# EAGLE design Feather-Extension (EAGLE 9.5.1)
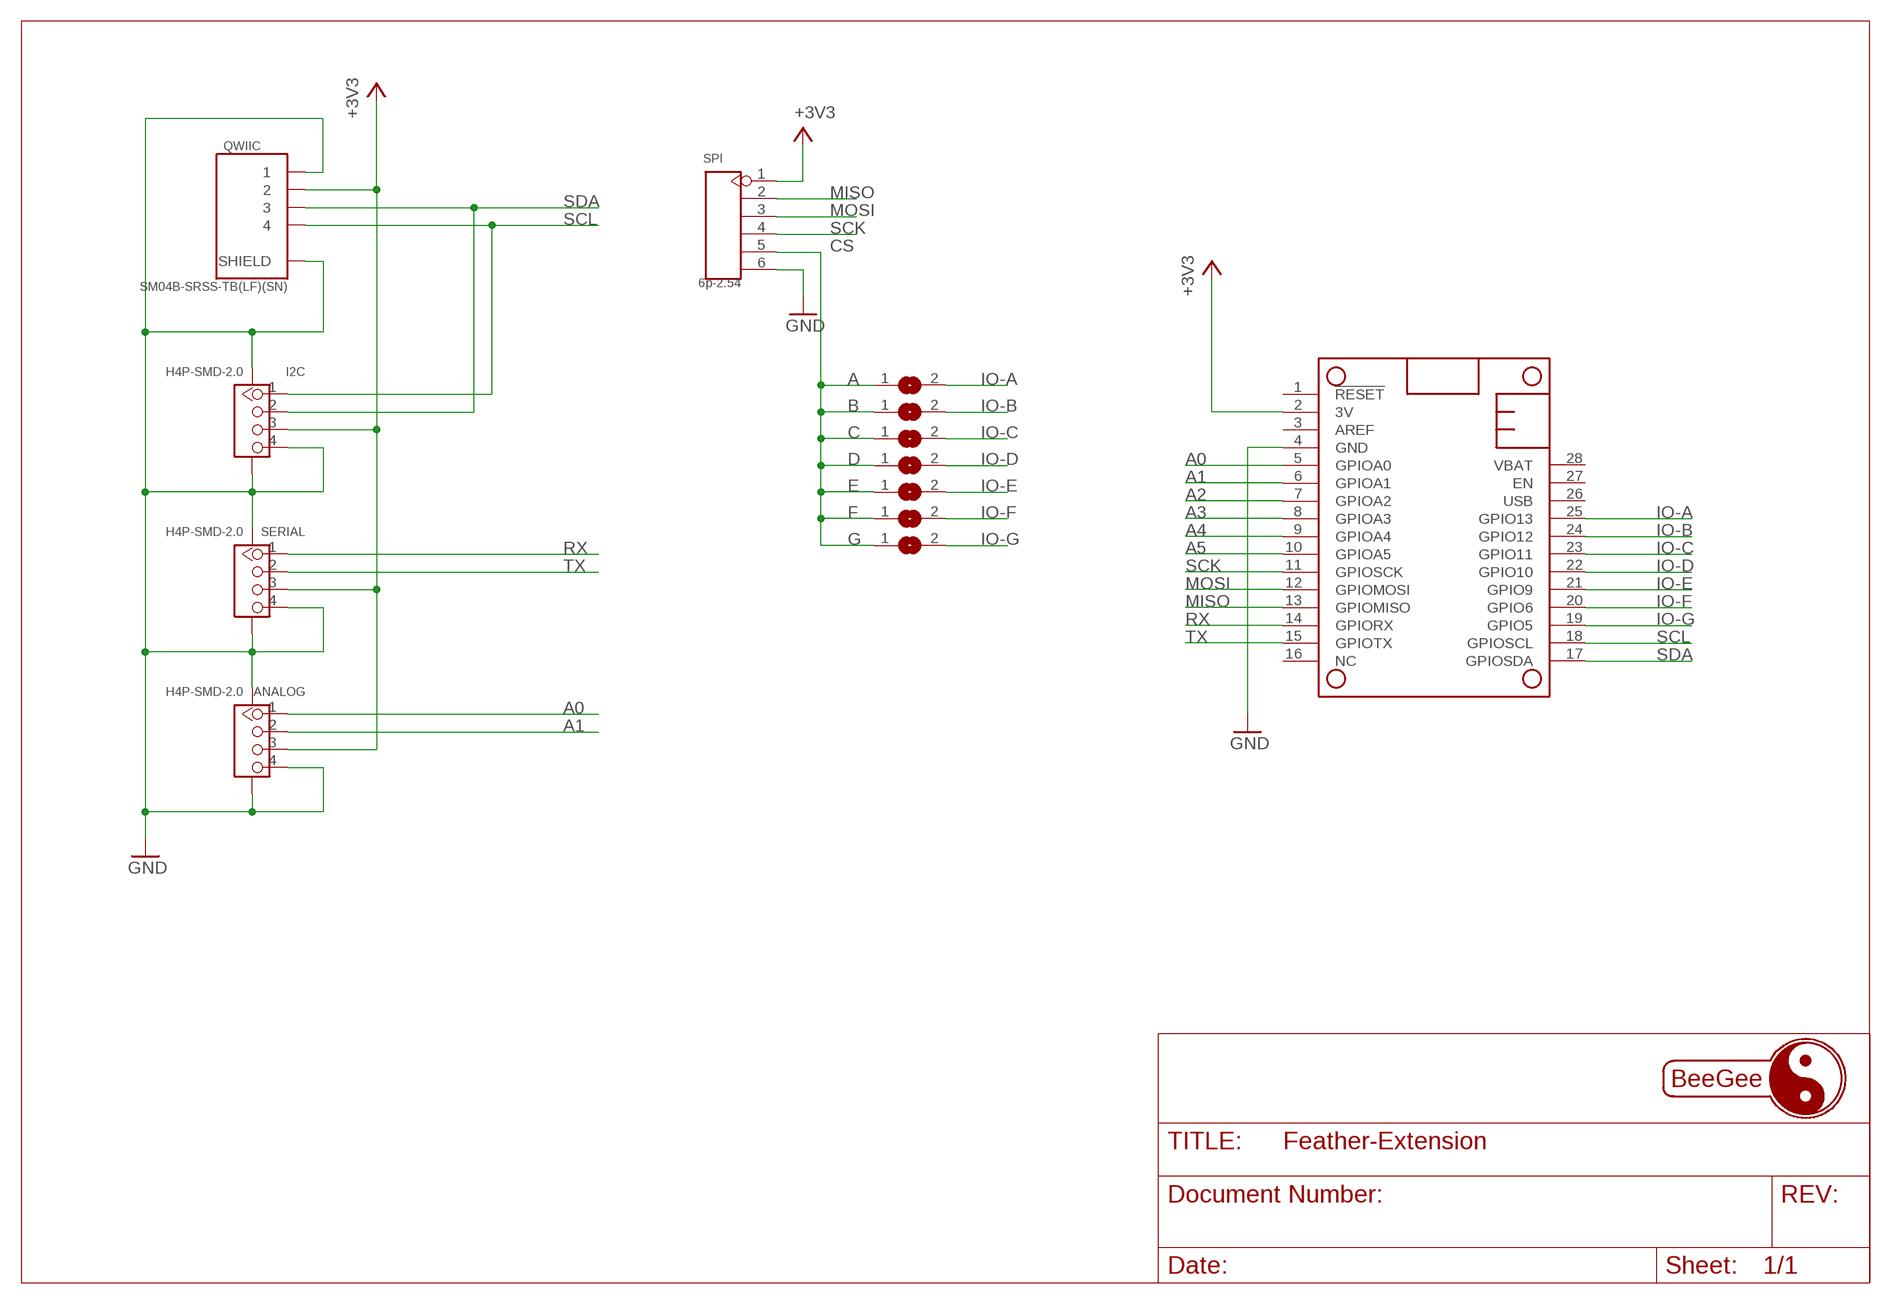
[diagram p0: schematic, sheet 1]

## Parts
A  SJ  [SJ]
ANALOG  H4P-SMD-2.0  GROVE-CONNECTOR-SMD(4+2P-2.0)  [HW4-SMD-2.0]
B  SJ  [SJ]
C  SJ  [SJ]
D  SJ  [SJ]
E  SJ  [SJ]
F  SJ  [SJ]
G  SJ  [SJ]
I2C  H4P-SMD-2.0  GROVE-CONNECTOR-SMD(4+2P-2.0)  [HW4-SMD-2.0]
MS2  FEATHERWING  [FEATHERWING]
QWIIC  SM04B-SRSS-TB(LF)(SN)  [JST_SM04B-SRSS-TB(LF)(SN)]
SERIAL  H4P-SMD-2.0  GROVE-CONNECTOR-SMD(4+2P-2.0)  [HW4-SMD-2.0]
SPI  6p-2.54  DIP-BLACK-MALE-HEADER(6P-2.54)  [H6-2.54]

## Nets
+3V3: ANALOG.3 I2C.3 MS2.2(3V) QWIIC.2 SERIAL.3 SPI.1
A0: ANALOG.1 MS2.5(GPIOA0)
A1: ANALOG.2 MS2.6(GPIOA1)
A2: MS2.7(GPIOA2)
A3: MS2.8(GPIOA3)
A4: MS2.9(GPIOA4)
A5: MS2.10(GPIOA5)
CS: A.1 B.1 C.1 D.1 E.1 F.1 G.1 SPI.5
GND [power]: ANALOG.4 ANALOG.SS1 ANALOG.SS2 I2C.4 I2C.SS1 I2C.SS2 MS2.4(GND) QWIIC.1 QWIIC.S1(SHIELD) QWIIC.S2(SHIELD) SERIAL.4 SERIAL.SS1 SERIAL.SS2 SPI.6
IO-A: A.2 MS2.25(GPIO13)
IO-B: B.2 MS2.24(GPIO12)
IO-C: C.2 MS2.23(GPIO11)
IO-D: D.2 MS2.22(GPIO10)
IO-E: E.2 MS2.21(GPIO9)
IO-F: F.2 MS2.20(GPIO6)
IO-G: G.2 MS2.19(GPIO5)
MISO: MS2.13(GPIOMISO) SPI.2
MOSI: MS2.12(GPIOMOSI) SPI.3
RX: MS2.14(GPIORX) SERIAL.1
SCK: MS2.11(GPIOSCK) SPI.4
SCL: I2C.1 MS2.18(GPIOSCL) QWIIC.4
SDA: I2C.2 MS2.17(GPIOSDA) QWIIC.3
TX: MS2.15(GPIOTX) SERIAL.2
Unconnected: MS2.1(!RESET) MS2.3(AREF) MS2.16(NC) MS2.26(USB) MS2.27(EN) MS2.28(VBAT)

## Library data of the parts
A B C D E F G = jumper:SJ: SMD solder JUMPER
ANALOG I2C SERIAL = OPL_Connector:GROVE-CONNECTOR-SMD(4+2P-2.0): 320110030; #1_SEEED_SKU: 320110030; #2_SEEED_LINK: https://www.seeedstudio.com/opl.html
MS2 = adafruit:FEATHERWING
QWIIC = SM04B-SRSS-TB_LF__SN_:SM04B-SRSS-TB(LF)(SN): SH Series 1.0 mm Pitch 2 Position Single Row Side Entry Shrouded Header; #1_SEEED_SKU: JST SM04B-SRSS-TB_LF_SN; #2_SEEED_LINK: https://order.jst-mfg.com/InternetShop/app/index.php?back=2&product=67585401&jgcd=0#showProductDetail; AVAILABILITY: Unavailable; DESCRIPTION: SH Series 1.0 mm Pitch 2 Position Single Row Side Entry Shrouded Header; MF: JST Sales; MP: SM04B-SRSS-TB_LF__SN_; PACKAGE: None; PRICE: None
SPI = OPL_Connector:DIP-BLACK-MALE-HEADER(6P-2.54): 320020078; #1_SEEED_LINK: https://www.seeedstudio.com/opl.html; #1_SEEED_SKU: 320020078; MPN: P125-1106A1BS116A1

## Net classes
1 power: width 0.356 mm

## Board
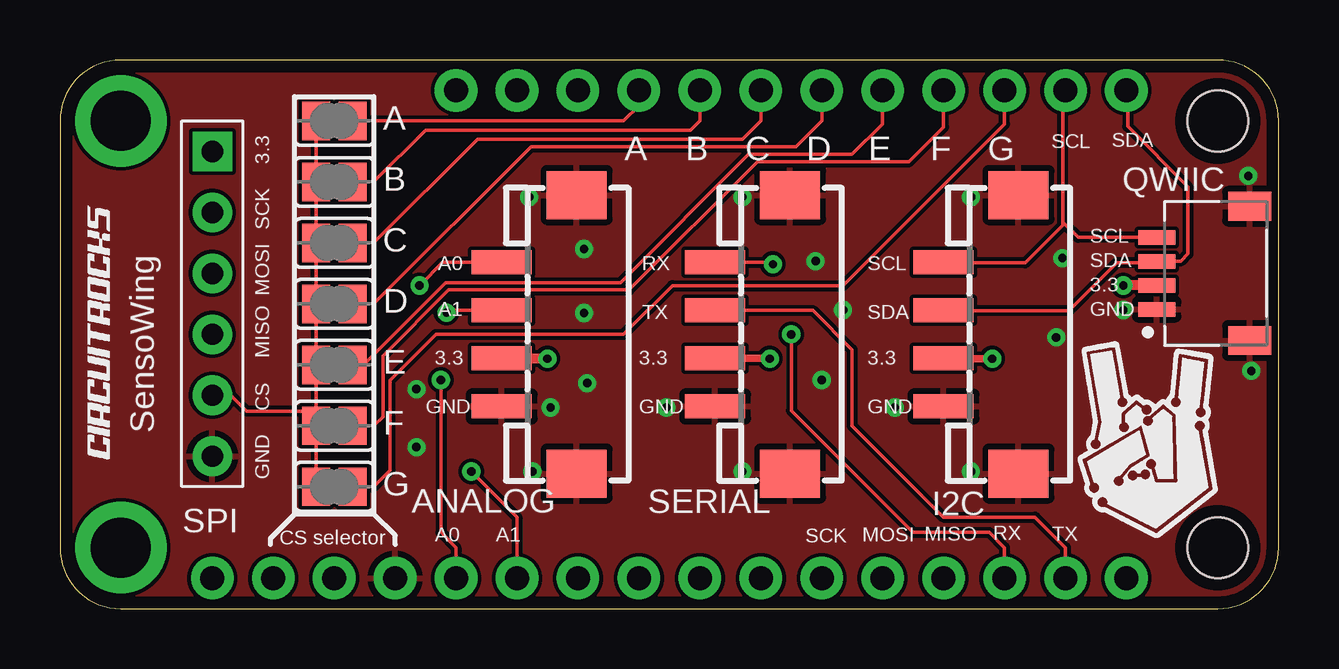
[diagram p1: board, top side]
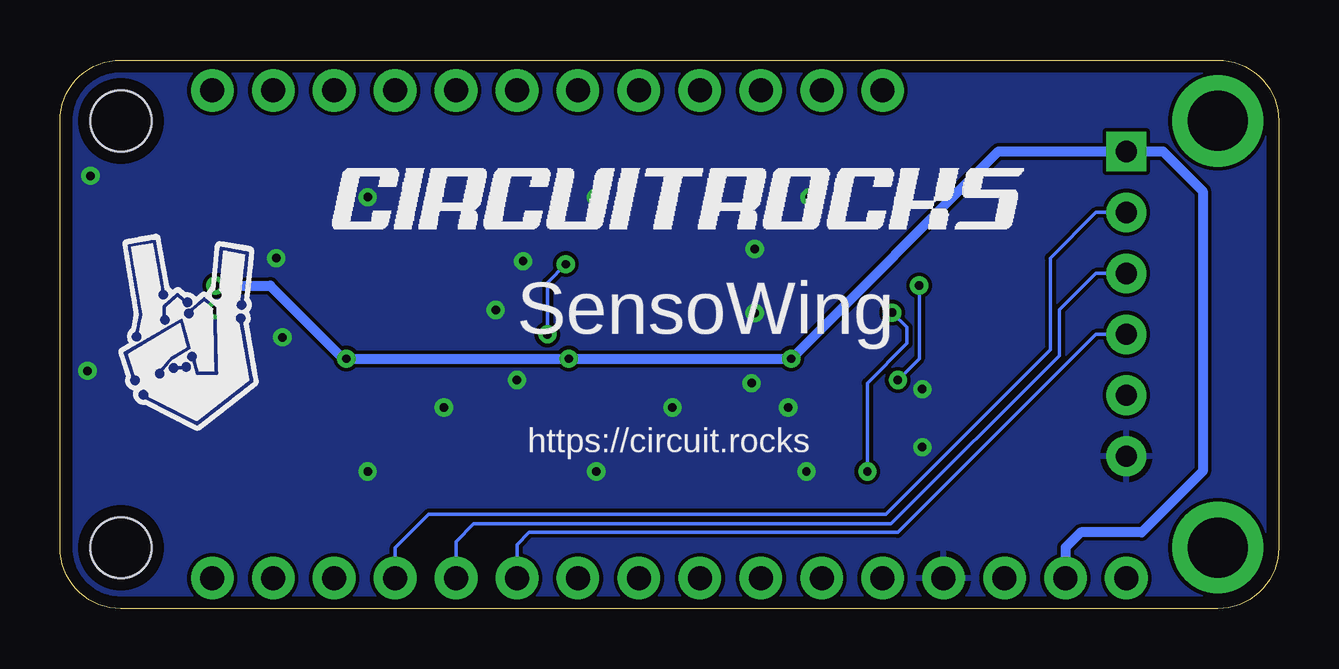
[diagram p2: board, bottom side, seen from below]

Size 50.8 x 22.86 mm. Coordinates in mm from the lower left corner, seen from the top.
Copper layers (1*16): Top 0.035mm / dielectric 1.5mm / Bottom 0.035mm
Design rules "default *": minimum track width 6mil, minimum drill 0.35mm, track to track 6mil, track to pad 6mil, pad to pad 6mil, via to via 6mil, smd to smd 6mil, copper to edge 20mil, drill to drill 6mil, minimum pad ring 10mil, minimum via ring 8mil, stop-mask expansion 4mil, vias tented up to drill 50mil, thermal gap 10mil

### Footprints (pad centres in the part's own frame; a part is rotated, then mirrored left to right if it is on the bottom)
SJ = smd 1.168 x 1.6: 1 -0.762,0; 2 0.762,0
HW4-SMD-2.0 = smd 1 x 2.5: 1 -3,0; 2 -1,0; 3 1,0; 4 3,0 | smd 2 x 2.5: SS1 -5.8,3.123; SS2 5.8,3.123
FEATHERWING = drill 1 pad 1.778: 1 6.35,1.27; 2 8.89,1.27; 3 11.43,1.27; 4 13.97,1.27; 5 16.51,1.27; 6 19.05,1.27; 7 21.59,1.27; 8 24.13,1.27; 9 26.67,1.27; 10 29.21,1.27; 11 31.75,1.27; 12 34.29,1.27; 13 36.83,1.27; 14 39.37,1.27; 15 41.91,1.27; 16 44.45,1.27; 17 44.45,21.59; 18 41.91,21.59; 19 39.37,21.59; 20 36.83,21.59; 21 34.29,21.59; 22 31.75,21.59; 23 29.21,21.59; 24 26.67,21.59; 25 24.13,21.59; 26 21.59,21.59; 27 19.05,21.59; 28 16.51,21.59 | drill 2.5 pad 3.81: P$1 2.54,20.32; P$2 2.54,2.54 | hole 2.54: 48.26,20.32; 48.26,2.54
JST_SM04B-SRSS-TB(LF)(SN) = smd 0.6 x 1.55: 1 -1.5,0; 2 -0.5,0; 3 0.5,0; 4 1.5,0 | smd 1.2 x 1.8: S1 -2.8,-3.875; S2 2.8,-3.875
H6-2.54 = drill 0.889 pad 1.651 square: 1 0,6.35 | drill 0.889 pad 1.651: 2 0,3.81; 3 0,1.27; 4 0,-1.27; 5 0,-3.81; 6 0,-6.35

### Placement (x,y rotation side)
A  11.43,20.32 0 top
ANALOG  18.41,11.43 270 top
B  11.43,17.78 0 top
C  11.43,15.24 0 top
D  11.43,12.7 0 top
E  11.43,10.16 0 top
F  11.43,7.62 0 top
G  11.43,5.08 0 top
I2C  36.83,11.43 270 top
MS2  0,0 0 top
QWIIC  45.72,13.97 90 top
SERIAL  27.3,11.43 270 top
SPI  6.35,12.7 0 top

### Tracks (layer width: path | path; a pad name or v marks a point on that pad's centre or on a via)
+3V3  (via drill 0.35)
  Top 0.305: 44.33,13.47 v44.32,13.46 | I2C.3 36.85,10.41 v38.86,10.41 | v29.59,10.41 29.57,10.43 SERIAL.3 | v20.32,10.41 20.3,10.43
  Top 0.406: QWIIC.2 44.33,13.47 | ANALOG.3 20.3,10.43
  Bottom 0.406: v44.32,13.46 42.04,13.46 38.99,10.41 v38.86,10.41 v29.59,10.41 v20.32,10.41 11.68,19.05 SPI.1 4.83,19.05 3.17,17.4 3.17,5.71 5.71,3.17 8.26,3.17 8.89,2.54 MS2.2
A0  (via drill 0.35)
  Top 0.152: ANALOG.1 15.95,14.43 v14.99,13.46 | v15.88,9.53 15.88,3.17 16.51,2.54 MS2.5
  Bottom 0.152: v14.99,13.46 14.99,10.41 v15.88,9.53
A1  (via drill 0.35)
  Top 0.152: ANALOG.2 16.24,12.43 16.13,12.32 v16.11,12.33 | v17.14,5.71 19.05,3.81 MS2.6
  Bottom 0.152: v16.11,12.33 15.49,11.71 15.49,11.05 17.14,9.4 v17.14,5.71
CS
  Top 0.152: A.1 B.1 C.1 D.1 E.1 10.67,8.23 | G.1 F.1 10.67,8.23 | 10.67,8.23 7.77,8.23 7.16,8.84 6.4,8.84 SPI.5
GND  (via drill 0.35)
  other vias: 19.68,5.71 28.45,5.71 37.97,5.71 49.66,9.91 49.53,18.03 44.32,12.45 34.8,8.38 19.56,17.14 28.45,17.14 37.97,17.14 20.45,8.38 25.27,8.38 41.53,11.3 41.78,14.61 32.64,12.45 31.75,9.53 31.5,14.48 14.86,6.73 14.86,9.14 21.84,14.99 21.84,12.32 21.97,9.4
  pour Bottom: 0,0 0,21.59 0,23.5 51.44,23.5 51.44,1.27 51.44,0
  pour Top: 0,0 0,16.51 0,24.13 48.9,24.13 51.44,24.13 51.44,0
IO-A
  Top 0.152: A.2 23.5,20.32 24.13,20.95 MS2.25
IO-B
  Top 0.152: B.2 13.08,17.78 15.24,19.94 26.29,19.94 26.67,20.32 MS2.24
IO-C
  Top 0.152: C.2 13.08,15.24 17.4,19.56 28.45,19.56 29.21,20.32 MS2.23
IO-D
  Top 0.152: MS2.22 31.75,20.32 30.68,19.25 19.63,19.25 13.08,12.7 D.2
IO-E
  Top 0.152: MS2.21 34.29,20.19 33.02,18.92 28.7,18.92 23.37,13.59 16.08,13.59 12.65,10.16 E.2
IO-F
  Top 0.152: F.2 13.08,7.62 13.46,8 13.46,10.54 16.2,13.28 23.73,13.28 29.06,18.62 35.38,18.62 36.83,20.07 MS2.20
IO-G
  Top 0.152: G.2 13.08,5.08 13.77,5.77 13.77,9.53 15.67,11.43 23.5,11.43 25.53,13.46 32.64,13.46 39.37,20.19 MS2.19
MISO
  Bottom 0.152: MS2.13 36.83,2.54 35.43,3.94 16.38,3.94 9.53,10.79 9.53,14.61 7.62,16.51 SPI.2
MOSI
  Bottom 0.152: SPI.3 7.62,13.97 9.14,12.45 9.14,10.54 16.16,3.53 33.56,3.53 34.29,2.79 MS2.12
RX  (via drill 0.35)
  Top 0.152: SERIAL.1 29.64,14.43 v29.72,14.35 | v30.48,11.43 30.48,8.26 35.56,3.17 38.73,3.17 39.37,2.54 MS2.14
  Bottom 0.152: v29.72,14.35 30.48,13.59 v30.48,11.43
SCK
  Bottom 0.152: SPI.4 7.62,11.43 15.88,3.17 31.24,3.17 31.75,2.67 MS2.11
SCL
  Top 0.152: 41.81,15.98 41.87,16.04 42.44,15.47 QWIIC.4 | 41.81,15.98 40.23,14.4 36.88,14.4 I2C.1 | 41.81,15.98 41.81,21.49 MS2.18
SDA
  Top 0.152: MS2.17 44.5,21.57 44.5,20.09 47.02,17.58 47.02,14.78 46.71,14.48 QWIIC.3 45.72,14.4 44.04,14.4 42.06,12.42 36.88,12.42 I2C.2
TX
  Top 0.152: SERIAL.2 31.39,12.43 33.02,10.79 33.02,7.62 36.83,3.81 40.64,3.81 41.91,2.54 MS2.15

### Text on the board
tNames: 3.3 | A | B | C | D | E | F | G | SCL | SDA | SCK | SCL | A0 | RX | SCL | SDA | MOSI | 3.3 | A1 | TX | SDA | GND | MISO | 3.3 | 3.3 | 3.3 | CS | GND | GND | GND | SensoWing | GND | CS selector | A0 | A1 | SCK | MOSI | MISO | RX | TX
bNames: SensoWing | https://circuit.rocks